# Altium schematic sheet SD Card Module.SchDoc: Micro SD Card Module
size A4; SheetNumber: 20; SheetTotal: 37
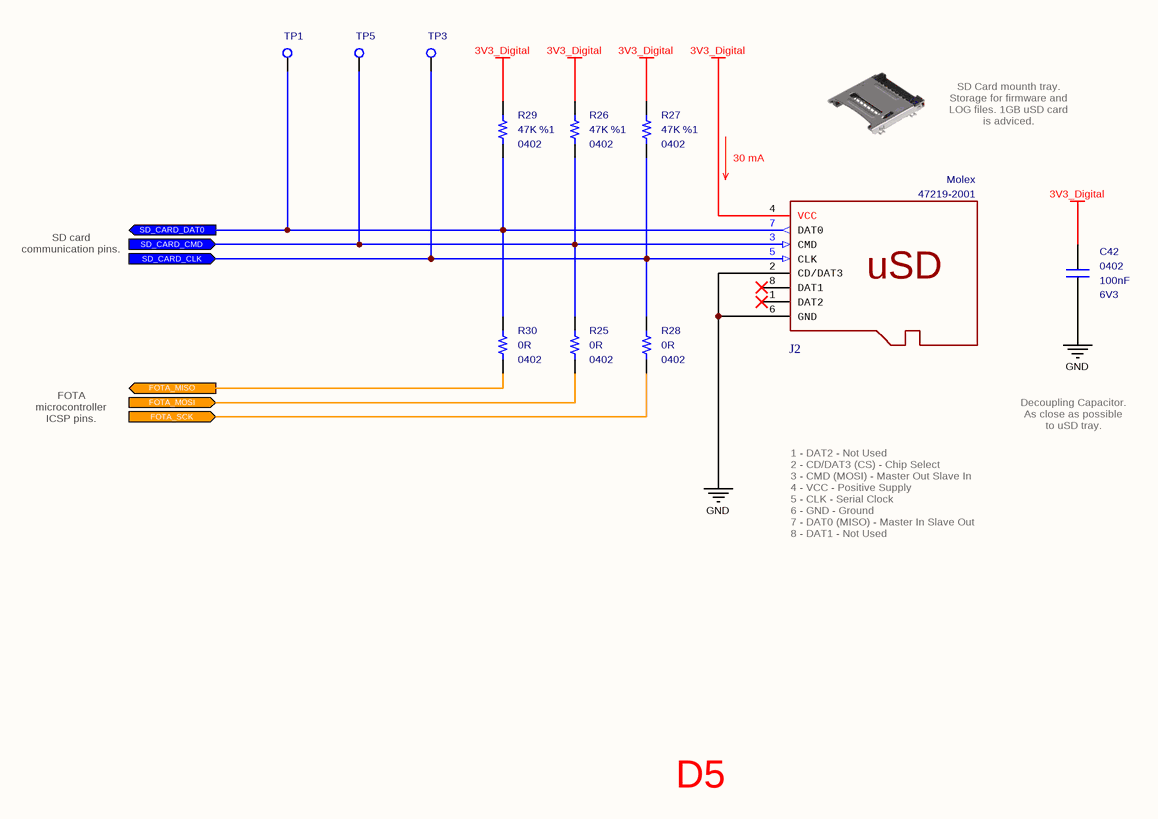
[diagram p0: SD Card Module.SchDoc]

## Parts
C42  value 100nF  Case: 0402  Voltage: 6V3  [CAPACITOR_0402]  (hidden comment: Multilayer Ceramic Capacitor)
J2  Manufacturer_Part_Number: 47219-2001  Manufacturer_Name: Molex  [Connector - SD Module]  (hidden comment: Memory Card Connectors)
R25  value 0R  Case: 0402  [RESISTOR_0402]  (hidden comment: Thick Film Resistor)
R26  value 47K  Tolerance: %1  Case: 0402  [RESISTOR_0402]  (hidden comment: Thick Film Resistor)
R27  value 47K  Tolerance: %1  Case: 0402  [RESISTOR_0402]  (hidden comment: Thick Film Resistor)
R28  value 0R  Case: 0402  [RESISTOR_0402]  (hidden comment: Thick Film Resistor)
R29  value 47K  Tolerance: %1  Case: 0402  [RESISTOR_0402]  (hidden comment: Thick Film Resistor)
R30  value 0R  Case: 0402  [RESISTOR_0402]  (hidden comment: Thick Film Resistor)
TP1  PCB - Test Point  [Test_Pad - Hole]  (value not drawn)  (no BOM)
TP3  PCB - Test Point  [Test_Pad - Hole]  (value not drawn)  (no BOM)
TP5  PCB - Test Point  [Test_Pad - Hole]  (value not drawn)  (no BOM)

## Ports
FOTA_MISO (out), FOTA_MOSI (in), FOTA_SCK (in), SD_CARD_CLK (in), SD_CARD_CMD (in), SD_CARD_DAT0 (out)

## Nets
3V3_Digital: C42.2 J2.4(VCC) R26.2 R27.2 R29.2
GND: C42.1 J2.2(CD/DAT3) J2.6(GND)
FOTA_MISO: R30.1 ; port FOTA_MISO
FOTA_MOSI: R25.1 ; port FOTA_MOSI
FOTA_SCK: R28.1 ; port FOTA_SCK
SD_CARD_CLK: J2.5(CLK) R27.1 R28.2 TP3.1 ; port SD_CARD_CLK
SD_CARD_CMD: J2.3(CMD) R25.2 R26.1 TP5.1 ; port SD_CARD_CMD
SD_CARD_DAT0: J2.7(DAT0) R29.1 R30.2 TP1.1 ; port SD_CARD_DAT0

Not connected (* = marked no-connect by the designer): J2 1(DAT2)* 8(DAT1)*

## Notes on the sheet
- 30 mA
- SD Card mounth tray. Storage for firmware and LOG files. 1GB uSD card is adviced.
- SD card communication pins.
- FOTA microcontroller ICSP pins.
- Decoupling Capacitor. As close as possible to uSD tray.
- 1 - DAT2 - Not Used
  2 - CD/DAT3 (CS) - Chip Select
  3 - CMD (MOSI) - Master Out Slave In
  4 - VCC - Positive Supply
  5 - CLK - Serial Clock
  6 - GND - Ground
  7 - DAT0 (MISO) - Master In Slave Out
  8 - DAT1 - Not Used
- D5
- Title
- Size:
- Date:
- A4
- Number:
- Time:
- Revision:
- Sheet
- of
- File:
- (in symbol Connector - SD Slot) uSD

## Library data of the parts
C42 = Capacitor - 100nF [0402-6V3]: Capacitor - 100nF [0402-6V3] (Ceramic); Manufacturer_Name: AVX; Manufacturer_Part_Number: 04026D104KAT4A; Dielectric: X5R; Tolerance: %10; Height: 0.25mm; Mouser_Part_Number: 581-04026D104KAT4A; ComponentLink1Description: Mouser; ComponentLink1URL: https://www.mouser.com.tr/ProductDetail/AVX/04026D104KAT4A?qs=sGAEpiMZZMs0AnBnWHyRQPg4iYkCw7IMED%2F4kpqgf7w%3D; ComponentLink2Description: DataSheet; ComponentLink2URL: https://www.mouser.com.tr/datasheet/2/40/cx5r-776519.pdf; ROHS: Yes; Maximum Operating Temperature: +85; Minimum Operating Temperature: -55; Supplier 1: Avnet; Supplier Part Number 1: 04026D104KAT4A
J2 = Connector - SD Slot: Memory Card Connectors TFR READER (HINGE TYPE); Card Type: microSD; Mouser_Part_Number: 538-47219-2001; Supplier 1: Avnet; Supplier 2: Farnell; Supplier 3: Newark; Supplier 4: Digi-Key; Supplier Part Number 2: 2614940; Supplier Part Number 1: 0472192001; Supplier Part Number 3: 32T4523; Supplier Part Number 4: WM6698CT-ND
R25 R28 R30 = Resistor - 0R: Thick Film Resistors - SMD 1/16 W 0 Ohms; Manufacturer_Name: Vishay; Manufacturer_Part_Number: CRCW04020000Z0ED; Height: 0.4mm; Mouser_Part_Number: 71-CRCW0402-0-E3; ComponentLink1Description: DataSheet; ComponentLink1URL: https://www.mouser.com.tr/datasheet/2/427/dcrcwe3-1762152.pdf; ComponentLink2Description: Mouser; ComponentLink2URL: https://www.mouser.com.tr/ProductDetail/Vishay-Dale/CRCW04020000Z0ED?qs=sGAEpiMZZMu61qfTUdNhG2DpbjADlD3GG34cJb50zyg%3D; Supplier 1: Mouser; Supplier 2: Digi-Key; Supplier Part Number 1: 71-CRCW0402-0-E3; Supplier Part Number 2: 541-0.0JCT-ND
R26 R27 R29 = Resistor - 47K: Thick Film Resistors - SMD 1/16 W 47 Kohms 1%; Manufacturer_Name: Vishay; Manufacturer_Part_Number: CRCW040247K0FKED; Height: 0.4mm; Mouser_Part_Number: 71-CRCW0402-47K-E3; ComponentLink1Description: DataSheet; ComponentLink1URL: https://www.mouser.com.tr/datasheet/2/427/dcrcwe3-1762152.pdf; ComponentLink2Description: Mouser; ComponentLink2URL: https://www.mouser.com.tr/ProductDetail/Vishay-Dale/CRCW040247K0FKED?qs=sGAEpiMZZMu61qfTUdNhG2DpbjADlD3GL%252B3h1elTxqU%3D; Supplier 1: Mouser; Supplier 2: Digi-Key; Supplier Part Number 1: 71-CRCW040247K0FKEDH; Supplier Part Number 2: 541-47.0KYCT-ND
TP1 TP3 TP5 = PCB - Test Point: Test Point